# EAGLE design open-usb-can (EAGLE 6.2)
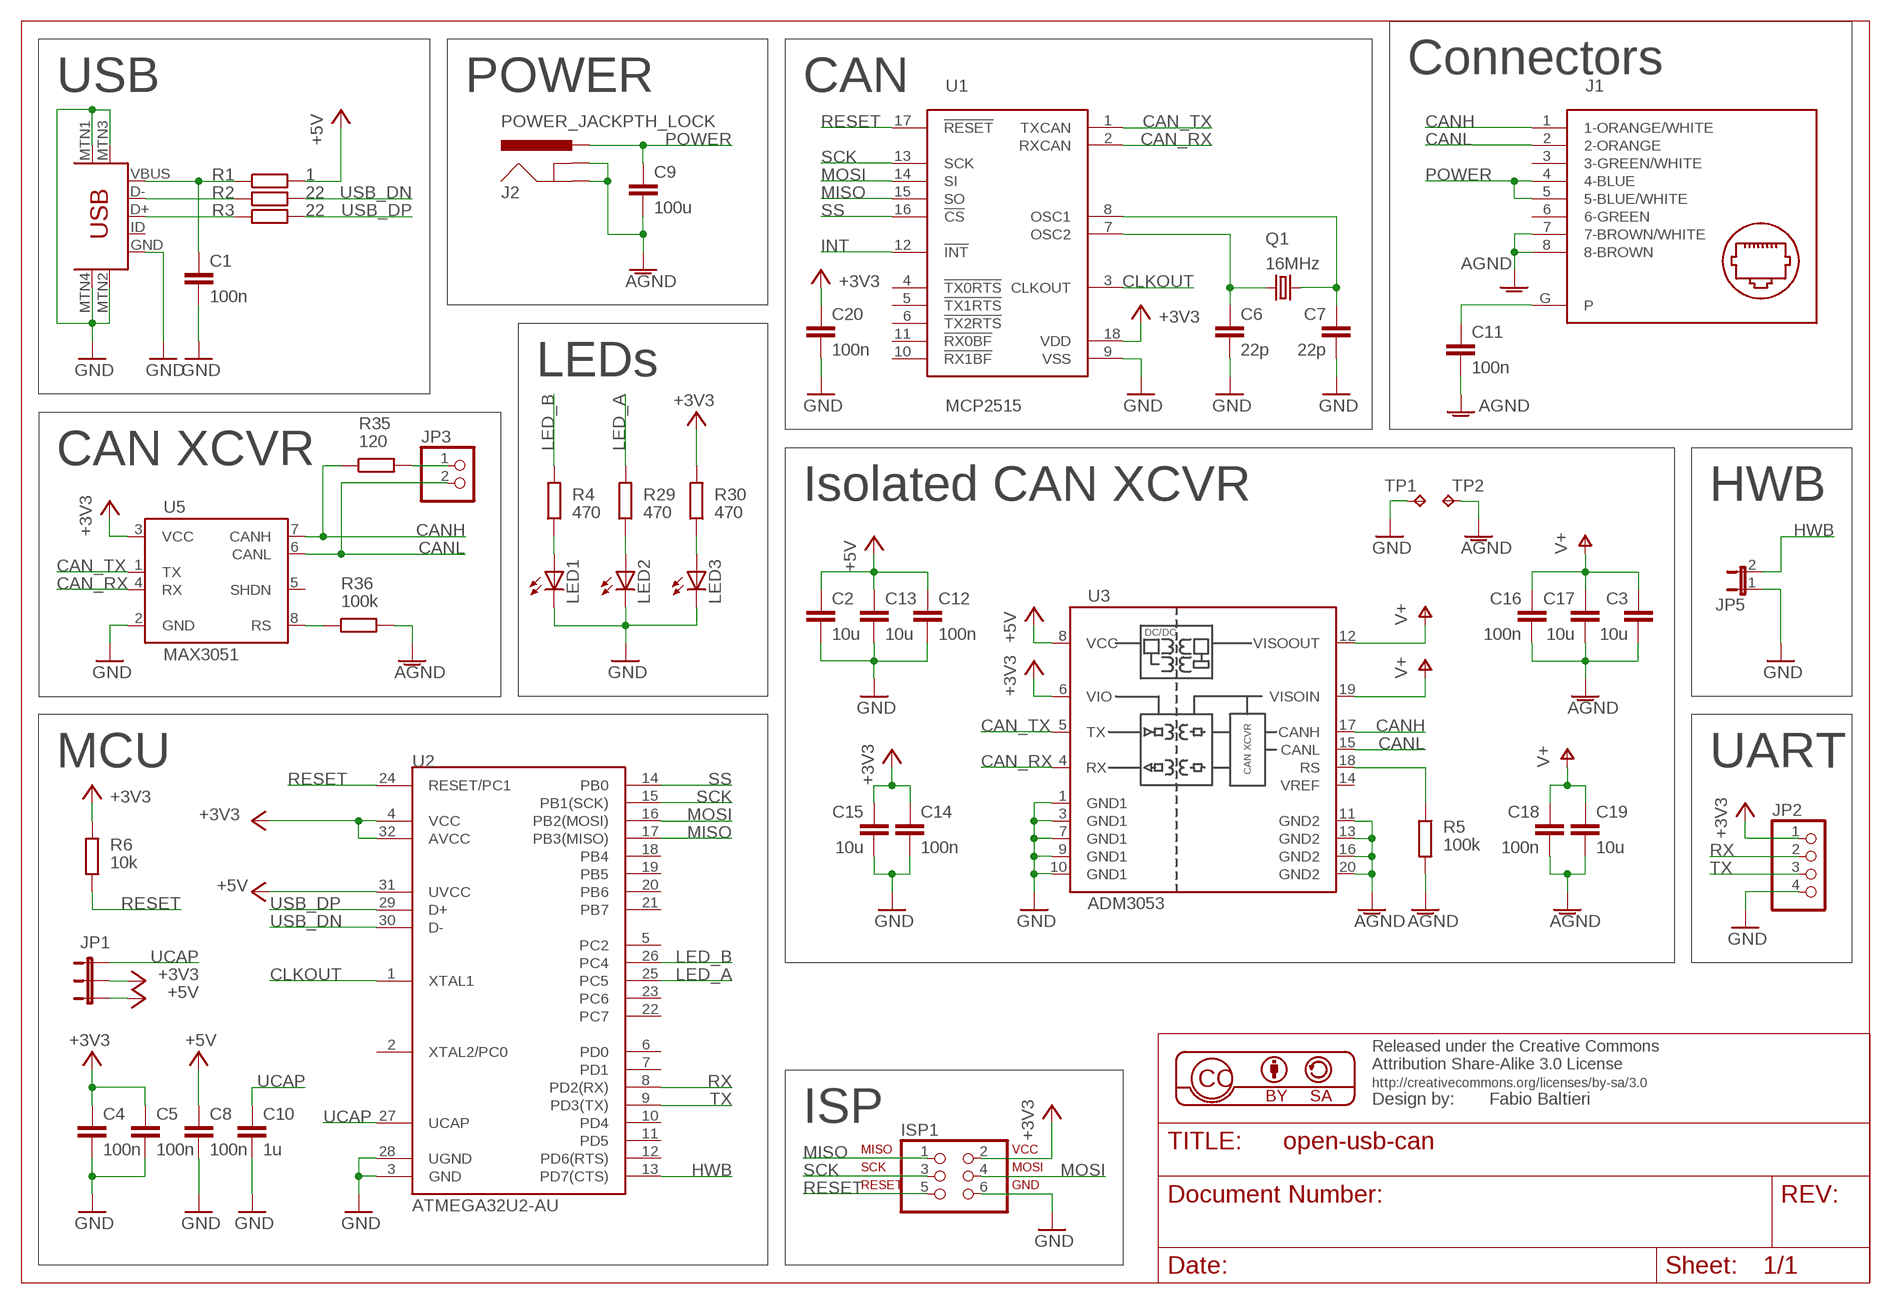
[diagram p0: schematic, sheet 1]

## Parts
C1  100n  C-EUC0805  [C0805]
C2  10u  C-EUC0805  [C0805]
C3  10u  C-EUC0805  [C0805]
C4  100n  C-EUC0805  [C0805]
C5  100n  C-EUC0805  [C0805]
C6  22p  C-EUC0805  [C0805]
C7  22p  C-EUC0805  [C0805]
C8  100n  C-EUC0805  [C0805]
C9  100u  C-EUC0805  [C0805]
C10  1u  C-EUC0805  [C0805]
C11  100n  C-EUC0805  [C0805]
C12  100n  C-EUC0805  [C0805]
C13  10u  C-EUC0805  [C0805]
C14  100n  C-EUC0805  [C0805]
C15  10u  C-EUC0805  [C0805]
C16  100n  C-EUC0805  [C0805]
C17  10u  C-EUC0805  [C0805]
C18  100n  C-EUC0805  [C0805]
C19  10u  C-EUC0805  [C0805]
C20  100n  C-EUC0805  [C0805]
ISP1  ISP-AVR910PTH  [2X03]
J1  NE8FAH  [NE8FAH]
J2  POWER_JACKPTH_LOCK  [POWER_JACK_PTH_LOCK]
JP1  JUMPER-3SMD  [SJ_3]
JP2  PINHD-1X4  [1X04]
JP3  PINHD-1X2  [1X02]
JP5  JUMPER-2-OLDPTH  [1X02]
LED1  LEDCHIPLED_1206  [CHIPLED_1206]
LED2  LEDCHIPLED_1206  [CHIPLED_1206]
LED3  LEDCHIPLED_1206  [CHIPLED_1206]
Q1  16MHz  CRYSTALHC49UV  [HC49U-V]
R1  1  R-EU_R0603  [R0603]
R2  22  R-EU_R0603  [R0603]
R3  22  R-EU_R0603  [R0603]
R4  470  R-EU_R0603  [R0603]
R5  100k  R-EU_R0603  [R0603]
R6  10k  R-EU_R0603  [R0603]
R29  470  R-EU_R0603  [R0603]
R30  470  R-EU_R0603  [R0603]
R35  120  R-EU_R0603  [R0603]
R36  100k  R-EU_R0603  [R0603]
TP1  TPTP16SQ  [TP16SQ]
TP2  TPTP16SQ  [TP16SQ]
U1  MCP2515  [SO-18DW]
U2  ATMEGA32U2-AU  ATMEGA8U2AU  [TQFP32-08]
U3  ADM3053  [SO20W]
U5  MAX3051  [SO08]
U$2  USB-MINIB-5PIN  [USB-MINIB]

## Nets
+3V3 [power12]: C4.1 C5.1 C14.1 C15.1 C20.1 ISP1.2 JP1.2 JP2.1 R6.1 R30.2 U1.18(VDD) U2.4(VCC) U2.32(AVCC) U3.6(VIO) U5.3(VCC)
+5V [power16]: C2.1 C8.1 C12.1 C13.1 JP1.1 R1.2 U2.31(UVCC) U3.8(VCC)
AGND: C3.2 C9.2 C11.2 C16.2 C17.2 C18.2 C19.2 J1.7(7-BROWN/WHITE) J1.8(8-BROWN) J2.GND J2.GNDBREAK R5.2 R36.2 TP2.TP U3.11(GND2) U3.13(GND2) U3.16(GND2) U3.20(GND2)
CAN_RX: U1.2(RXCAN) U3.4(RX) U5.4(RX)
CAN_TX: U1.1(TXCAN) U3.5(TX) U5.1(TX)
CANH: J1.1(1-ORANGE/WHITE) R35.1 U3.17(CANH) U5.7(CANH)
CANL: J1.2(2-ORANGE) JP3.2 U3.15(CANL) U5.6(CANL)
CLKOUT: U1.3(CLKOUT) U2.1(XTAL1)
GND: C1.2 C2.2 C4.2 C5.2 C6.2 C7.2 C8.2 C10.2 C12.2 C13.2 C14.2 C15.2 C20.2 ISP1.6 JP2.4 JP5.1 LED1.C LED2.C LED3.C TP1.TP U1.9(VSS) U2.3(GND) U2.28(UGND) U3.1(GND1) U3.3(GND1) U3.7(GND1) U3.9(GND1) U3.10(GND1) U5.2(GND) U$2.GND U$2.MTN1(MTN2) U$2.MTN2(MTN3) U$2.MTN3(MTN1) U$2.MTN4
HWB: JP5.2 U2.13(PD7(CTS))
INT: U1.12(!INT)
LED_A: R29.2 U2.25(PC5)
LED_B: R4.2 U2.26(PC4)
MISO: ISP1.1 U1.15(SO) U2.17(PB3(MISO))
MOSI: ISP1.4 U1.14(SI) U2.16(PB2(MOSI))
N$1 [power16]: C1.1 R1.1 U$2.VBUS
N$2: R2.1 U$2.D-
N$3: R3.1 U$2.D+
N$4: C7.1 Q1.2 U1.8(OSC1)
N$5: C6.1 Q1.1 U1.7(OSC2)
N$8: LED1.A R4.1
N$9: C11.1 J1.G(P)
N$11: R5.1 U3.18(RS)
N$23: LED2.A R29.1
N$24: LED3.A R30.1
N$25: R36.1 U5.8(RS)
N$27: JP3.1 R35.2
POWER: C9.1 J1.4(4-BLUE) J1.5(5-BLUE/WHITE) J2.PWR
RESET: ISP1.5 R6.2 U1.17(!RESET) U2.24(RESET/PC1)
RX: JP2.2 U2.8(PD2(RX))
SCK: ISP1.3 U1.13(SCK) U2.15(PB1(SCK))
SS: U1.16(!CS) U2.14(PB0)
TX: JP2.3 U2.9(PD3(TX))
UCAP [power12]: C10.1 JP1.3 U2.27(UCAP)
USB_DN: R2.2 U2.30(D-)
USB_DP: R3.2 U2.29(D+)
V+: C3.1 C16.1 C17.1 C18.1 C19.1 U3.12(VISOOUT) U3.19(VISOIN)
Unconnected: J1.3(3-GREEN/WHITE) J1.6(6-GREEN) U1.4(!TX0RTS) U1.5(!TX1RTS) U1.6(!TX2RTS) U1.10(!RX1BF) U1.11(!RX0BF) U2.2(XTAL2/PC0) U2.5(PC2) U2.6(PD0) U2.7(PD1) U2.10(PD4) U2.11(PD5) U2.12(PD6(RTS)) U2.18(PB4) U2.19(PB5) U2.20(PB6) U2.21(PB7) U2.22(PC7) U2.23(PC6) U3.2(NC) U3.14(VREF) U5.5(SHDN) U$2.ID

## Notes on the sheet
- Connectors
- USB | POWER | CAN
- LEDs
- CAN XCVR
- Isolated CAN XCVR | HWB
- MCU | UART
- ISP

## Library data of the parts
C1-C20 = rcl:C-EU: CAPACITOR, European symbol
ISP1 = balto:ISP-AVR910: PIN HEADER
J1 = audio:NE8FAH: Ethercon NE8FAH Horizonal PCB mount RJ45 receptacle, A-Series cutout with latch lock, max. panel thickness 3 mm
J2 = sparkfun:POWER_JACK: Power Jack This is the standard 5.5mm barrel jack for power. The PTH is the most common, proven, reliable, footprint. All others are experimental. The Slot footprint only works if the mill layer is transmitted to the PCB fab house so be warned. Spark Fun Electronics SKU : PRT-00119. Mating wall wart : TOL-00298 (and others)
JP1 = sparkfun:JUMPER-3
JP2 = pinhead:PINHD-1X4: PIN HEADER
JP3 = pinhead:PINHD-1X2: PIN HEADER
JP5 = sparkfun:JUMPER-2-OLD: Jumper Basic 0.1" spaced jumper. Use with breakaway headers.
LED1-LED3 = led:LED: LED OSRAM: - CHIPLED LG R971, LG N971, LY N971, LG Q971, LY Q971, LO R971, LY R971 LH N974, LH R974 LS Q976, LO Q976, LY Q976 LO Q996 - Hyper CHIPLED LW Q18S LB Q993, LB Q99A, LB R99A - SideLED LS A670, LO A670, LY A670, LG A670, LP A670 LB A673, LV A673, LT A673, LW A673 LH A674 LY A675 LS A676, LA A676, LO A676, LY A676, LW A676 LS A679, LY A679, LG A679 - Hyper Micro SIDELED® LS Y876, LA Y876, LO Y876, LY Y876 LT Y87S - SmartLED LW L88C, LW L88S LB L89C, LB L89S, LG L890 LS L89K, LO L89K, LY L89K LS L896, LA L896, LO L896, LY L896 - TOPLED LS T670, LO T670, LY T670, LG T670, LP T670 LSG T670, LSP T670, LSY T670, LOP T670, LYG T670 LG T671, LOG T671, LSG T671 LB T673, LV T673, LT T673, LW T673 LH T674 LS T676, LA T676, LO T676, LY T676, LB T676, LH T676, LSB T676, LW T676 LB T67C, LV T67C, LT T67C, LS T67K, LO T67K, LY T67K, LW E67C LS E67B, LA E67B, LO E67B, LY E67B, LB E67C, LV E67C, LT E67C LW T67C LS T679, LY T679, LG T679 LS T770, LO T770, LY T770, LG T770, LP T770 LB T773, LV T773, LT T773, LW T773 LH T774 LS E675, LA E675, LY E675, LS T675 LS T776, LA T776, LO T776, LY T776, LB T776 LHGB T686 LT T68C, LB T68C - Hyper Mini TOPLED® LB M676 - Mini TOPLED Santana® LG M470 LS M47K, LO M47K, LY M47K Source: http://www.osram.convergy.de LUXEON: - LUMILED® LXK2-PW12-R00, LXK2-PW12-S00, LXK2-PW14-U00, LXK2-PW14-V00 LXK2-PM12-R00, LXK2-PM12-S00, LXK2-PM14-U00 LXK2-PE12-Q00, LXK2-PE12-R00, LXK2-PE12-S00, LXK2-PE14-T00, LXK2-PE14-U00 LXK2-PB12-K00, LXK2-PB12-L00, LXK2-PB12-M00, LXK2-PB14-N00, LXK2-PB14-P00, LXK2-PB14-Q00 LXK2-PR12-L00, LXK2-PR12-M00, LXK2-PR14-Q00, LXK2-PR14-R00 LXK2-PD12-Q00, LXK2-PD12-R00, LXK2-PD12-S00 LXK2-PH12-R00, LXK2-PH12-S00 LXK2-PL12-P00, LXK2-PL12-Q00, LXK2-PL12-R00 Source: www.luxeon.com KINGBRIGHT: KA-3528ASYC Source: www.kingbright.com
Q1 = sparkfun:CRYSTAL: Crystals Various standard crystals. Proven footprints. Spark Fun Electronics SKU : COM-00534
R1-R6 R29 R30 R35 R36 = rcl:R-EU_: RESISTOR, European symbol
TP1 TP2 = testpad:TP: Test pad
U1 = balto:MCP2515
U2 = sparkfun:ATMEGA8U2: Atmel 8-bit Microcontroller with 8/16/32K Bystes of ISP Flash and USB Controller. ATmega8U2, ATmega16U2, and ATmega32U2
U3 = balto:ADM3053
U5 = balto:MAX3051
U$2 = sparkfun:USB-MINIB: Mini-USB "B" connector with 5th pin broken out. Created new symbol breaking out 5th "ID" pin in mini/micro USB connector spec. See: http://en.wikipedia.org/wiki/Mini_usb#Cables. Uses same footprint as 4-pin symbol. Also added pins to connect to mounting / shield pads if required (probably not generally needed as signals aren't shielded once they leave the connector).

## Net classes
1 power12: width 0.305 mm
2 power16: width 0.406 mm

## Board
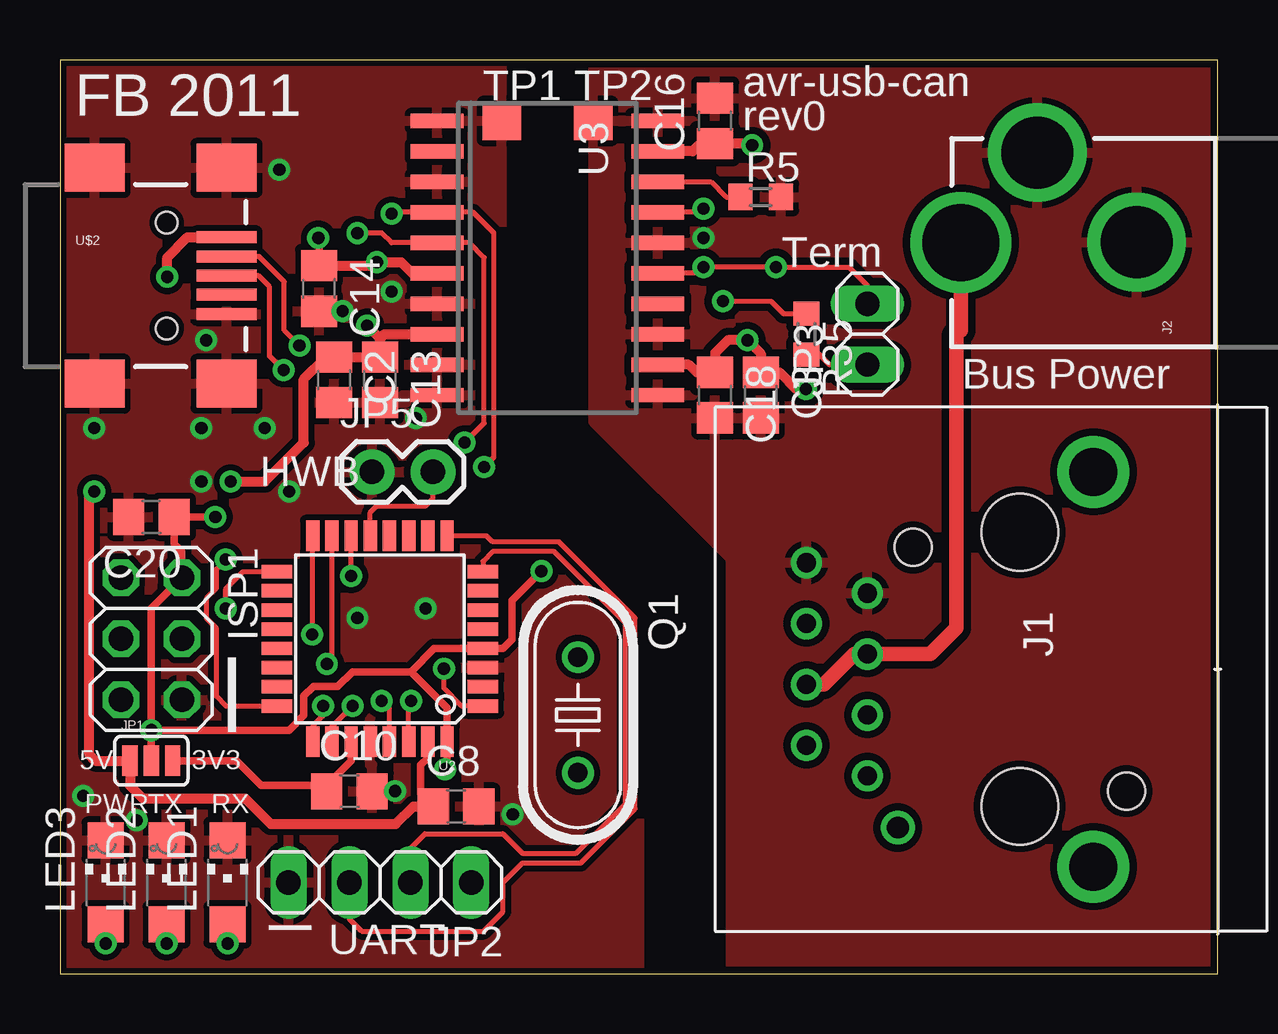
[diagram p1: board, top side]
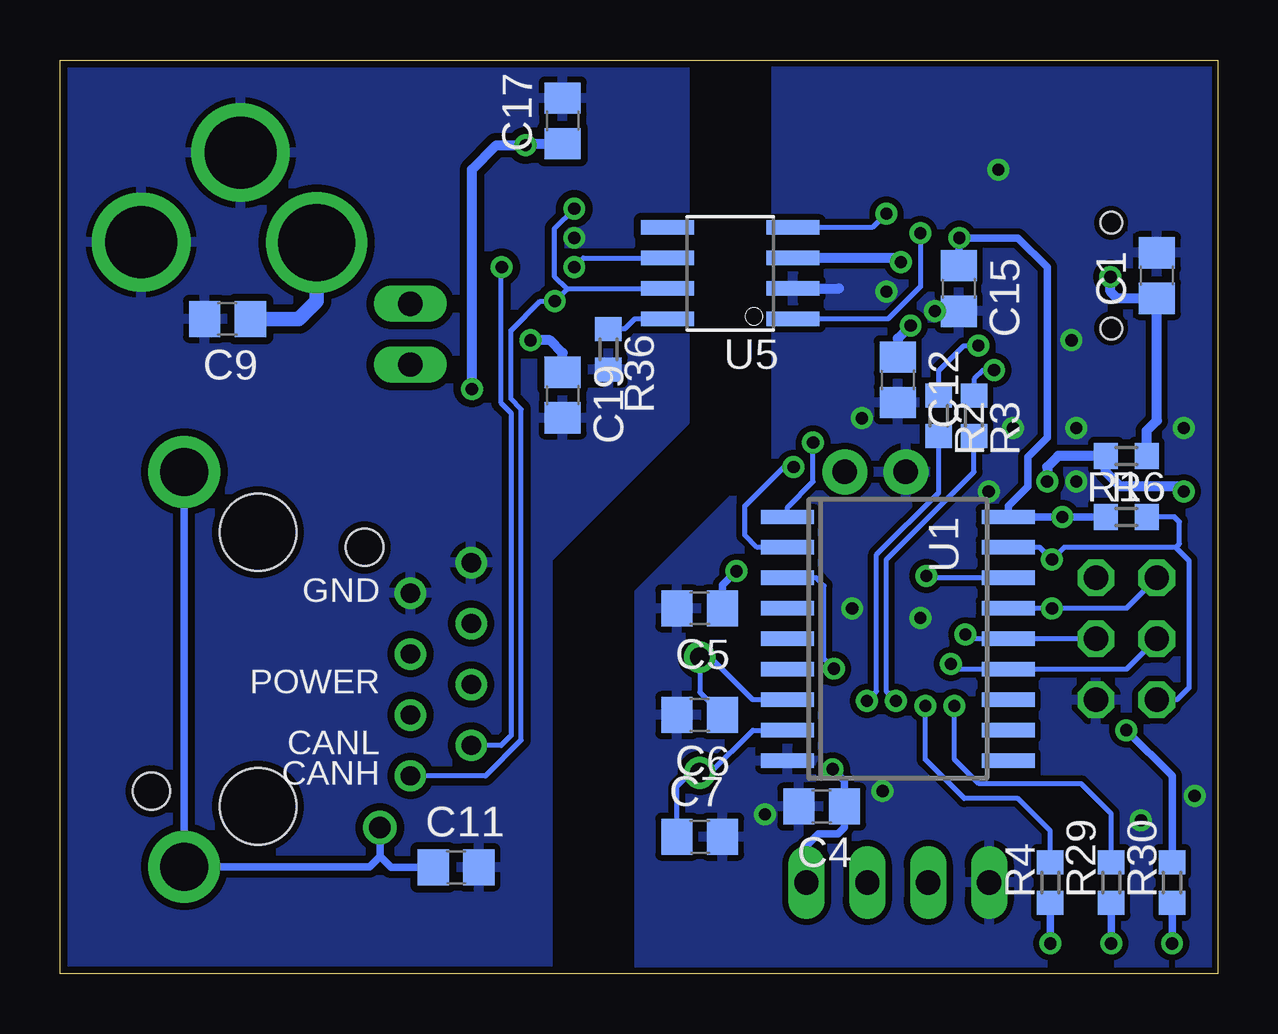
[diagram p2: board, bottom side, seen from below]

Size 48.26 x 38.1 mm. Coordinates in mm from the lower left corner, seen from the top.
Outline: 0,0 48.26,0 48.26,38.1 0,38.1 0,0
Copper layers (1*16): Top 0.035mm / dielectric 1.5mm / Bottom 0.035mm
Design rules: minimum track width 8mil, minimum drill 20mil, track to track 8mil, track to pad 8mil, pad to pad 8mil, via to via 8mil, smd to smd 8mil, copper to edge 8mil, drill to drill 8mil, minimum pad ring 10mil, minimum via ring 8mil, stop-mask expansion 4mil, vias tented up to drill 20mil, thermal gap 10mil
Holes 3.2 mm at 40.01,18.41 40.01,6.99

### Footprints (pad centres in the part's own frame; a part is rotated, then mirrored left to right if it is on the bottom)
C0805 = smd 1.3 x 1.5: 1 -0.95,0; 2 0.95,0
2X03 = drill 1.016 octagon: 1 -2.54,-1.27; 2 -2.54,1.27; 3 0,-1.27; 4 0,1.27; 5 2.54,-1.27; 6 2.54,1.27
NE8FAH = drill 0.8: 1 0,0; 2 -1.27,-2.54; 3 -2.54,0; 4 -3.81,-2.54; 5 -5.08,0; 6 -6.35,-2.54; 7 -7.62,0; 8 -8.89,-2.54 | drill 0.9: G 2.159,1.27 | hole 1.55: -9.525,1.905; 0.635,10.795
POWER_JACK_PTH_LOCK = drill 2.997 pad 4.115: GND 0.025,6.557; GNDBREAK 3.762,10.7 | drill 3.2 pad 4.115: PWR 0,13.878
SJ_3 = smd 0.635 x 1.27: 1 -0.889,0; 2 0,0; 3 0.889,0
1X04 = drill 1.016 long: 1 -3.81,0; 2 -1.27,0; 3 1.27,0; 4 3.81,0
1X02 = drill 1.016 long: 1 -1.27,0; 2 1.27,0
1X02' = drill 1.016 pad 1.88: 1 0,0; 2 2.54,0
CHIPLED_1206 = smd 1.5 x 1.5: A 0,-1.75; C 0,1.75
HC49U-V = drill 0.813: 1 -2.413,0; 2 2.413,0
R0603 = smd 1 x 1.1: 1 -0.85,0; 2 0.85,0
TP16SQ = smd 1.6 x 1.6: TP 0,0
SO-18DW = smd 0.6 x 2.2: 1 -5.08,-4.6; 2 -3.81,-4.6; 3 -2.54,-4.6; 4 -1.27,-4.6; 5 0,-4.6; 6 1.27,-4.6; 7 2.54,-4.6; 8 3.81,-4.6; 9 5.08,-4.6; 10 5.08,4.6; 11 3.81,4.6; 12 2.54,4.6; 13 1.27,4.6; 14 0,4.6; 15 -1.27,4.6; 16 -2.54,4.6; 17 -3.81,4.6; 18 -5.08,4.6
TQFP32-08 = smd 1.27 x 0.559: 1 -4.293,2.8; 2 -4.293,2; 3 -4.293,1.2; 4 -4.293,0.4; 5 -4.293,-0.4; 6 -4.293,-1.2; 7 -4.293,-2; 8 -4.293,-2.8; 17 4.293,-2.8; 18 4.293,-2; 19 4.293,-1.2; 20 4.293,-0.4; 21 4.293,0.4; 22 4.293,1.2; 23 4.293,2; 24 4.293,2.8 | smd 0.559 x 1.27: 9 -2.8,-4.293; 10 -2,-4.293; 11 -1.2,-4.293; 12 -0.4,-4.293; 13 0.4,-4.293; 14 1.2,-4.293; 15 2,-4.293; 16 2.8,-4.293; 25 2.8,4.293; 26 2,4.293; 27 1.2,4.293; 28 0.4,4.293; 29 -0.4,4.293; 30 -1.2,4.293; 31 -2,4.293; 32 -2.8,4.293
SO20W = smd 0.6 x 2.2: 1 -5.715,-4.6; 2 -4.445,-4.6; 3 -3.175,-4.6; 4 -1.905,-4.6; 5 -0.635,-4.6; 6 0.635,-4.6; 7 1.905,-4.6; 8 3.175,-4.6; 9 4.445,-4.6; 10 5.715,-4.6; 11 5.715,4.6; 12 4.445,4.6; 13 3.175,4.6; 14 1.905,4.6; 15 0.635,4.6; 16 -0.635,4.6; 17 -1.905,4.6; 18 -3.175,4.6; 19 -4.445,4.6; 20 -5.715,4.6
SO08 = smd 0.61 x 2.21: 1 -1.905,-2.616; 2 -0.635,-2.616; 3 0.635,-2.616; 4 1.905,-2.616; 5 1.905,2.616; 6 0.635,2.616; 7 -0.635,2.616; 8 -1.905,2.616
USB-MINIB = smd 2.5 x 0.5: D+ 2.5,0; D- 2.5,0.8; GND 2.5,-1.6; ID 2.5,-0.8; VBUS 2.5,1.6 | smd 2.5 x 2: MTN1 -3,4.5; MTN2 2.5,4.5; MTN3 -3,-4.5; MTN4 2.5,-4.5 | hole 0.9: 0,2.2; 0,-2.2

### Placement (x,y rotation side)
C1  2.54,29.11 90 bottom
C2  11.43,24.77 270 top
C3  29.21,24.13 270 top
C4  16.51,6.99 180 bottom
C5  21.59,15.24 180 bottom
C6  21.59,10.79 180 bottom
C7  21.59,5.71 0 bottom
C8  16.51,6.99 0 top
C9  41.27,27.3 180 bottom
C10  12.06,7.62 0 top
C11  31.75,4.45 0 bottom
C12  13.34,24.77 270 bottom
C13  13.34,24.77 270 top
C14  10.79,28.57 270 top
C15  10.79,28.57 270 bottom
C16  27.3,35.56 90 top
C17  27.3,35.56 90 bottom
C18  27.3,24.13 270 top
C19  27.3,24.13 270 bottom
C20  3.81,19.05 180 top
ISP1  3.81,13.97 270 top
J1  33.66,8.26 270 top
J2  51.44,30.48 90 top
JP1  3.81,8.89 0 top
JP2  13.34,3.81 180 top
JP3  33.66,26.67 90 top
JP5  [1X02']  13,20.93 0 top
LED1  6.99,3.81 0 top
LED2  4.45,3.81 0 top
LED3  1.91,3.81 0 top
Q1  21.59,10.79 270 top
R1  3.81,21.59 180 bottom
R2  11.63,23.27 270 bottom
R3  10.16,23.27 270 bottom
R4  6.99,3.81 90 bottom
R5  29.21,32.38 0 top
R6  3.81,19.05 0 bottom
R29  4.45,3.81 90 bottom
R30  1.91,3.81 90 bottom
R35  31.11,26.67 270 top
R36  25.4,26.04 270 bottom
TP1  18.41,35.56 0 top
TP2  22.23,35.56 0 top
U1  13.34,13.97 270 bottom
U2  13.34,13.97 180 top
U3  20.32,29.84 270 top
U5  20.32,29.21 90 bottom
U$2  4.45,29.11 0 top

### Tracks (layer width: path | path; a pad name or v marks a point on that pad's centre or on a via)
+3V3  (via drill 0.51)
  Top 0.305: v20.07,16.79 18.85,15.57 18.85,13.95 18.47,13.57 U2.4 15.6,13.57 14.63,12.6 | v3.81,10.16 JP1.2 | v3.81,10.16 3.81,15.24 ISP1.2 5.08,17.6 4.76,17.92 C20.1 v6.48,19.05 | 14.63,12.6 16.14,11.09 U2.32 16.14,8.62 v16.05,8.53 | v3.81,10.16 9.55,10.16 10.16,10.77 10.16,11.58 10.57,11.99 11.58,11.99 12.19,12.6 14.63,12.6 | C14.1 10.79,30.66 v10.77,30.68
  Top 0.406: U3.6 14.68,29.21 14.22,29.67 v13.21,29.67 13.07,29.53 C14.1
  Bottom 0.305: 15.56,8.02 C4.1 15.56,6.11 15.82,5.84 16.64,5.84 17.14,5.33 JP2.1 | C5.1 20.64,16.21 v20.07,16.79 | R30.2 1.91,8.26 v3.81,10.16 | R6.1 v6.48,19.05 U1.18 8.73,19.51 7.92,20.32 7.92,21.54 7.11,22.35 7.11,29.46 8.33,30.68 v10.77,30.68 10.79,30.66 C14.1 | 15.56,8.04 15.56,8.02 | 15.56,8.04 15.56,8.02 | v16.05,8.53 15.56,8.04
  Bottom 0.406: U5.3 13.39,29.84 v13.21,29.67
+5V  (via drill 0.51)
  Top 0.305: U2.31 15.34,9.01 15.04,8.71 15.04,7.51 C8.1
  Top 0.406: 13.34,26.49 C12.1 C2.1 11.09,25.71 10.16,24.79 10.16,22.15 8.53,20.52 v7.11,20.52 | 13.34,26.49 v12.8,27.03 | U3.8 13.51,26.67 13.34,26.49 | C8.1 14.73,6.99 13.99,6.25 8.79,6.25 7.72,7.32 3.45,7.32 2.92,7.85 JP1.1 1.47,8.89 1.22,9.14 1.22,19.91 v1.42,20.12
  Bottom 0.406: C12.1 13.34,26.49 v12.8,27.03 | v1.42,20.12 1.63,20.32 4.06,20.32 4.66,20.92 R1.2 6.66,21.59 7.11,21.13 v7.11,20.52
AGND  (via drill 0.51)
  other vias: 26.82,30.68
  pour Top (isolate 0.305): 48.26,38.1 22.23,38.1 22.23,23.01 27.94,17.3 27.94,0 48.26,0
  pour Bottom (isolate 0.305): 48.26,38.1 22.23,38.1 22.23,23.01 27.94,17.3 27.94,0 48.26,0
CAN_RX  (via drill 0.51)
  Top 0.203: v13.82,31.7 13.87,31.75 U3.4 17.22,31.75 18.09,30.89 18.09,21.54 v17.68,21.13
  Bottom 0.203: U5.4 14.4,31.11 v13.82,31.7 | U1.2 19.2,17.78 19.71,18.29 19.71,19.51 18.09,21.13 v17.68,21.13
CAN_TX  (via drill 0.51)
  Top 0.203: v12.39,30.89 13.41,30.89 13.82,30.48 U3.5 17.07,30.48 17.68,29.87 17.68,22.96 v16.87,22.15
  Bottom 0.203: v12.39,30.89 12.39,28.65 13.74,27.3 U5.1 | v16.87,22.15 16.87,20.52 17.93,19.45 U1.1
CANH  (via drill 0.51)
  Top 0.203: U3.17 26.67,31.75 v26.82,31.9 | v27.64,28.04 29.64,28.04 30.16,27.52 R35.1
  Bottom 0.203: 27.15,28.57 U5.7 | 27.15,28.57 27.64,29.06 27.64,31.09 v26.82,31.9 | 27.15,28.57 27.15,28.52 v27.64,28.04 28.25,28.04 29.46,26.82 29.46,23.98 29.03,23.55 29.03,9.75 30.53,8.26 J1.1
CANL  (via drill 0.51)
  Top 0.203: U3.15 26.57,29.21 v26.82,29.46 v29.84,29.46 32.89,29.46 33.66,28.7 JP3.2
  Bottom 0.203: U5.6 26.44,29.84 v26.82,29.46 | J1.2 29.87,9.53 29.44,9.96 29.44,23.37 29.87,23.8 29.87,29.44 v29.84,29.46
CLKOUT  (via drill 0.51)
  Top 0.203: U2.1 16.75,11.17 16,11.91 v16,12.72
  Bottom 0.203: U1.3 16.74,16.51 16.41,16.18 16.41,13.13 v16,12.72
GND  (via drill 0.51)
  Bottom 0.406: U5.2 15.77,28.57
  other vias: 13.82,28.45 18.87,6.65 14.83,23.16 13.97,7.62 9.14,33.53 5.89,20.52 8.53,22.76 11.79,27.64 9.55,20.12 5.89,22.76 3.2,6.4 12.4,14.83 15.24,15.24 1.42,22.76 0.97,7.42 6.1,26.42
  pour Bottom (isolate 0.254): 24.13,0 0,0 0,38.1 18.41,38.1 18.41,21.59 24.13,15.88
  pour Top (isolate 0.254): 24.13,-0.03 0,0 0,38.1 18.41,38.07 18.41,21.59 24.13,15.88
HWB
  Top 0.203: U2.13 12.94,19.23 13.21,19.51 15.24,19.51 15.54,19.81 JP5.2
LED_A  (via drill 0.51)
  Top 0.203: U2.25 10.54,10.33 10.97,10.77 v10.97,11.18
  Bottom 0.203: R29.2 4.45,6.68 5.69,7.92 9.96,7.92 10.97,8.94 v10.97,11.18
LED_B  (via drill 0.51)
  Top 0.203: U2.26 11.34,10.32 v12.19,11.18
  Bottom 0.203: R4.2 6.99,5.97 8.33,7.32 10.57,7.32 12.19,8.94 v12.19,11.18
MISO  (via drill 0.51)
  Top 0.203: U2.17 7.63,16.77 6.91,16.05 v6.91,15.24
  Bottom 0.203: ISP1.1 3.81,15.24 v6.91,15.24 U1.15
MOSI  (via drill 0.51)
  Top 0.203: U2.16 10.54,14.17 v10.52,14.15
  Bottom 0.203: v10.52,14.15 10.34,13.97 U1.14 ISP1.4
N$1  (via drill 0.51)
  Top 0.406: U$2.VBUS 5.31,30.71 4.47,29.87 v4.47,29.06
  Bottom 0.406: v4.47,29.06 4.47,28.45 4.18,28.16 C1.1 2.54,23.06 2.96,22.64 R1.1
N$2  (via drill 0.51)
  Top 0.203: U$2.D- 8.29,29.91 9.35,28.85 9.35,26.82 v9.98,26.19
  Bottom 0.203: 11.63,24.54 R2.1 11.63,25.15 10.59,26.19 v9.98,26.19
N$3  (via drill 0.51)
  Top 0.203: 9.14,25.35 v9.32,25.17 8.74,25.76 8.74,28.65 8.28,29.11 U$2.D+
  Bottom 0.203: 10.16,24.33 R3.1 10.16,24.79 9.78,25.17 v9.32,25.17
N$4
  Bottom 0.203: U1.8 19.38,10.16 21.16,8.38 Q1.2 21.97,8.38 22.54,7.81 C7.1
N$5
  Bottom 0.203: U1.7 19.38,11.43 21.16,13.21 Q1.1 21.59,11.74 C6.1
N$8  (via drill 0.51)
  Top 0.305: LED1.A v6.99,1.27
  Bottom 0.305: v6.99,1.27 R4.1
N$9  (via drill 2)
  Bottom 0.305: v43.08,20.93 v43.08,4.47 35.36,4.47 34.92,4.9 | 34.92,4.9 J1.G | C11.1 34.47,4.45 34.92,4.9
N$11
  Top 0.203: U3.18 27.13,33.02 27.76,32.38 R5.1
N$23  (via drill 0.51)
  Top 0.305: LED2.A v4.45,1.27
  Bottom 0.305: v4.45,1.27 R29.1
N$24  (via drill 0.51)
  Top 0.305: LED3.A v1.91,1.27
  Bottom 0.305: v1.91,1.27 R30.1
N$25
  Bottom 0.203: U5.8 24.31,27.3 24.73,26.89 R36.1
N$27
  Top 0.203: R35.2 31.66,25.82 32.08,25.4 JP3.1
POWER
  Top 0.61: J1.4 31.85,12.06 33.12,13.34 J1.5 36.27,13.34 37.36,14.43 37.36,26.62 37.56,26.81 J2.PWR
  Bottom 0.61: J2.PWR 37.56,28.05 38.3,27.3 C9.1
RESET  (via drill 0.51)
  Top 0.203: v6.91,17.27 6.5,16.87 6.5,16.05 6.1,15.65 6.1,14.83 6.5,14.43 6.5,11.58 6.92,11.17 U2.24
  Bottom 0.203: 1.75,17.78 1.19,17.22 1.19,11.94 1.7,11.43 ISP1.5 | R6.2 1.8,19.05 1.6,18.85 1.6,17.93 1.75,17.78 | U1.17 7.42,17.78 v6.91,17.27 6.4,17.78 1.75,17.78
RX
  Top 0.203: U2.8 17.63,17.2 18.03,17.6 20.6,17.6 23.57,14.63 23.57,7.09 21.51,5.03 19.28,5.03 18.47,5.84 15.21,5.84 14.61,5.23 JP2.2
SCK  (via drill 0.51)
  Top 0.203: U2.15 11.34,13.14 v11.12,12.93
  Bottom 0.203: v11.12,12.93 10.9,12.7 U1.13 3.81,12.7 ISP1.3
SS  (via drill 0.51)
  Top 0.203: U2.14 v12.13,16.59 v12.14,16.59
  Bottom 0.203: U1.16 12.06,16.51 v12.14,16.59
TX
  Top 0.203: U2.9 17.78,18.26 18.03,18.01 20.8,18.01 23.98,14.83 23.98,6.88 21.72,4.62 19.28,4.62 18.47,3.81 18.47,2.59 17.65,1.78 12.57,1.78 12.06,2.29 JP2.3
UCAP
  Top 0.305: U2.27 12.13,8.88 11.12,7.86 | 11.12,7.86 C10.1 | 11.12,7.86 8.39,7.86 7.37,8.89 JP1.3
USB_DN  (via drill 0.51)
  Top 0.203: U2.30 14.54,11.28 v14.63,11.38
  Bottom 0.203: v14.63,11.38 14.22,11.79 14.22,17.48 11.63,20.07 R2.2
USB_DP  (via drill 0.51)
  Top 0.203: U2.29 13.73,11.05 v13.41,11.38
  Bottom 0.203: v13.41,11.38 13.82,11.79 13.82,17.27 10.16,20.93 R3.2
V+  (via drill 0.51)
  Top 0.406: U3.19 26.36,34.29 26.62,34.54 27.24,34.54 C17.1 28.79,34.61 v28.85,34.54 | U3.12 26.21,25.4 26.53,25.08 C19.1 27.3,25.88 27.84,26.42 v28.65,26.42 29.21,25.86 C3.1 29.99,25.08 30.68,24.38 v31.09,24.38
  Bottom 0.406: C17.1 28.79,34.61 v28.85,34.54 30.07,34.54 31.09,33.53 v31.09,24.38 | C19.1 27.3,25.88 27.84,26.42 v28.65,26.42

### Text on the board
_tsilk: avr-usb-can | FB 2011 | rev0 | Term | Bus Power | HWB | _ | 5V | 3V3 | PWR | TX | RX | _ | UART
_bsilk: GND | POWER | CANL | CANH